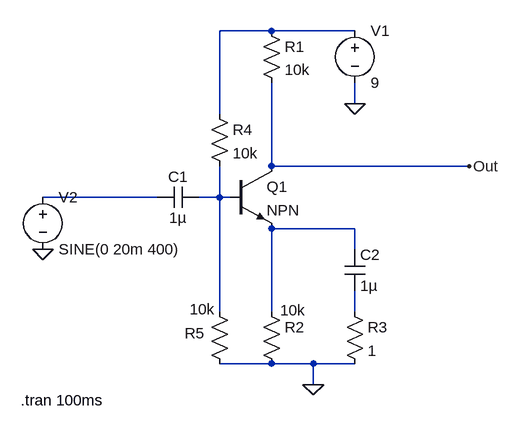
[diagram p0: schematic Draft3.asc]
Draft3.asc, the LTspice schematic file:
Version 4
SHEET 1 880 680
WIRE 240 -96 160 -96
WIRE 368 -96 240 -96
WIRE 368 16 368 -16
WIRE 160 32 160 -96
WIRE 240 112 240 -16
WIRE 544 112 240 112
WIRE 64 160 -112 160
WIRE 160 160 160 112
WIRE 160 160 128 160
WIRE 176 160 160 160
WIRE 368 208 240 208
WIRE 368 240 368 208
WIRE 160 336 160 160
WIRE 240 336 240 208
WIRE 368 336 368 304
WIRE 240 416 160 416
WIRE 304 416 240 416
WIRE 368 416 304 416
WIRE 304 448 304 416
FLAG 304 448 0
FLAG 368 16 0
FLAG -112 240 0
FLAG 544 112 Out
SYMBOL cap 64 176 R270
WINDOW 0 32 32 VTop 2
WINDOW 3 0 32 VBottom 2
SYMATTR InstName C1
SYMATTR Value 1µ
SYMBOL res 224 -112 R0
SYMATTR InstName R1
SYMATTR Value 10k
SYMBOL res 224 320 R0
WINDOW 3 -110 12 Left 2
SYMATTR InstName R2
SYMATTR Value 10k
SYMBOL res 352 320 R0
SYMATTR InstName R3
SYMATTR Value 1
SYMBOL npn 176 112 R0
SYMATTR InstName Q1
SYMBOL res 144 16 R0
SYMATTR InstName R4
SYMATTR Value 10k
SYMBOL res 144 320 R0
WINDOW 0 -38 49 Left 2
WINDOW 3 109 14 Left 2
SYMATTR InstName R5
SYMATTR Value 10k
SYMBOL voltage 368 -112 R0
WINDOW 123 0 0 Left 2
WINDOW 39 0 0 Left 2
SYMATTR InstName V1
SYMATTR Value 9
SYMBOL voltage -112 144 R0
WINDOW 123 0 0 Left 2
WINDOW 39 0 0 Left 2
SYMATTR InstName V2
SYMATTR Value SINE(0 20m 400)
SYMBOL cap 352 240 R0
SYMATTR InstName C2
SYMATTR Value 1µ
TEXT -146 472 Left 2 !.tran 100ms

The netlist it stands for:
* Draft3.asc
C1 N002 N003 1µ
R1 N001 Out 10k
R2 N004 0 10k
R3 N005 0 1
Q1 Out N003 N004 0 NPN
R4 N001 N003 10k
R5 N003 0 10k
V1 N001 0 9
V2 N002 0 SINE(0 20m 400)
C2 N004 N005 1µ
.model NPN NPN
.model PNP PNP
.lib standard.bjt
.tran 100ms
.backanno
.end